# Altium project RS2-708_V010.PrjPCB (part 3 of 6)

## Sheet Serial.SchDoc
size A4
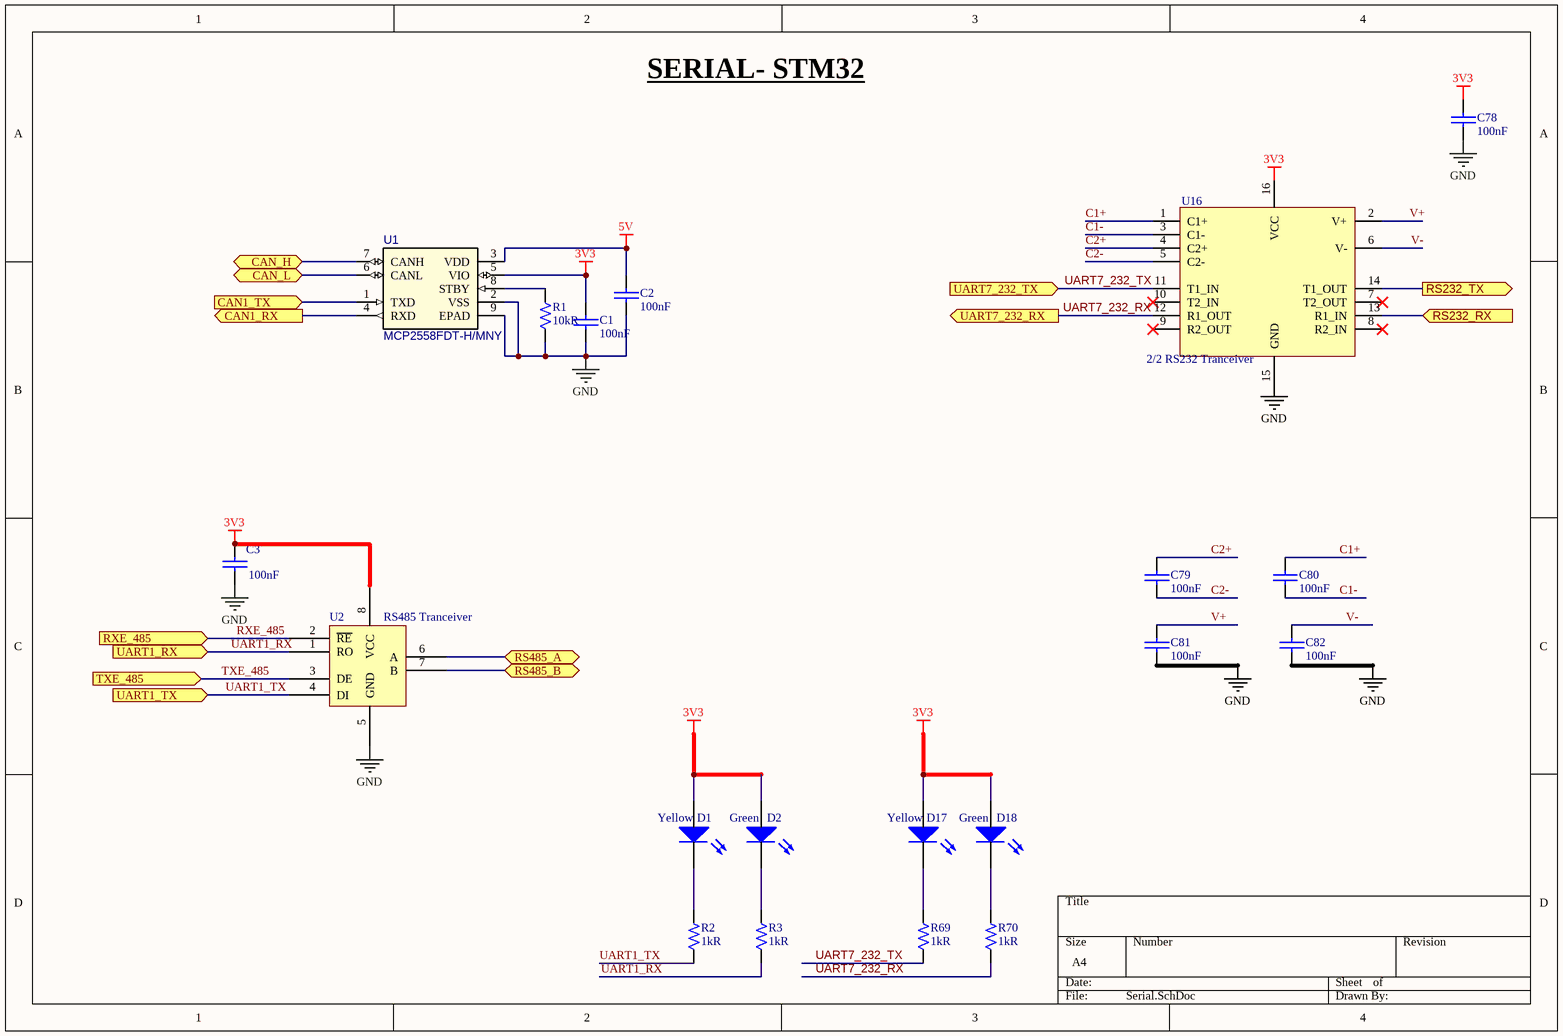
[diagram p4: Serial.SchDoc]

### Parts
C1  Capacitance: 100nF  [CAP0402]  (hidden comment: Capacitor)
C2  Capacitance: 100nF  [CAP0402]  (hidden comment: Capacitor)
C3  Capacitance: 100nF  [CAP0402]  (hidden comment: Capacitor)
C78  Capacitance: 100nF  [CAP0402]  (hidden comment: Capacitor)
C79  Capacitance: 100nF  [CAP0402]  (hidden comment: Capacitor)
C80  Capacitance: 100nF  [CAP0402]  (hidden comment: Capacitor)
C81  Capacitance: 100nF  [CAP0402]  (hidden comment: Capacitor)
C82  Capacitance: 100nF  [CAP0402]  (hidden comment: Capacitor)
D1  Colour: Yellow  [LED-0603-YELLOW]  (hidden comment: LED)
D2  Colour: Green  [LED-0603-GREEN]  (hidden comment: LED)
D17  Colour: Yellow  [LED-0603-YELLOW]  (hidden comment: LED)
D18  Colour: Green  [LED-0603-GREEN]  (hidden comment: LED)
R1  Resistance: 10kR  [RES0402]  (hidden comment: Resistor)
R2  Resistance: 1kR  [RES0402]  (hidden comment: Resistor)
R3  Resistance: 1kR  [RES0402]  (hidden comment: Resistor)
R69  Resistance: 1kR  [RES0402]  (hidden comment: Resistor)
R70  Resistance: 1kR  [RES0402]  (hidden comment: Resistor)
U1  MCP2558FDT-H/MNY  [TDFN8_2x3_MN]
U2  RS485 Tranceiver  [MAX22501EATA+]
U16  2/2 RS232 Tranceiver  [ST3232ECTR]

### Ports
CAN1_RX (out), CAN1_TX (in), CAN_H (bidir), CAN_L (bidir), RS232_RX (in), RS232_TX (out), RS485_A (bidir), RS485_B (bidir), RXE_485 (in), TXE_485 (in), UART1_RX (in), UART1_TX (in), UART7_232_RX (out), UART7_232_TX (in)

### Nets
3V3: C1.1 C3.1 C78.1 D1.2 D2.2 D17.2 D18.2 U1.5(VIO) U2.8(VCC) U16.16(VCC)
5V: C2.1 U1.3(VDD)
GND: C1.2 C2.2 C3.2 C78.2 C81.2 C82.2 R1.1 U1.2(VSS) U1.9(EPAD) U2.5(GND) U16.15(GND)
C1+: C80.1 U16.1(C1+)
C1-: C80.2 U16.3(C1-)
C2+: C79.1 U16.4(C2+)
C2-: C79.2 U16.5(C2-)
CAN1_RX: U1.4(RXD) ; port CAN1_RX
CAN1_TX: U1.1(TXD) ; port CAN1_TX
CAN_H: U1.7(CANH) ; port CAN_H
CAN_L: U1.6(CANL) ; port CAN_L
RS232_RX: U16.13(R1_IN) ; port RS232_RX
RS232_TX: U16.14(T1_OUT) ; port RS232_TX
RS485_A: U2.6(A) ; port RS485_A
RS485_B: U2.7(B) ; port RS485_B
RXE_485: U2.2(~{RE}) ; port RXE_485
TXE_485: U2.3(DE) ; port TXE_485
UART1_RX: R3.1 U2.1(RO) ; port UART1_RX
UART1_TX: R2.1 U2.4(DI) ; port UART1_TX
UART7_232_RX: R70.1 U16.12(R1_OUT) ; port UART7_232_RX
UART7_232_TX: R69.1 U16.11(T1_IN) ; port UART7_232_TX
V+: C81.1 U16.2(V+)
V-: C82.1 U16.6(V-)
NetD1_1: D1.1 R2.2
NetD2_1: D2.1 R3.2
NetD17_1: D17.1 R69.2
NetD18_1: D18.1 R70.2
NetR1_2: R1.2 U1.8(STBY)

Not connected (* = marked no-connect by the designer): U16 7(T2_OUT)* 8(R2_IN)* 9(R2_OUT)* 10(T2_IN)*

### Notes on the sheet
- SERIAL- STM32

### Library data of the parts
C1-C3 C78-C82 = Capacitor: Manufacturer: TDK; Manufacturer Part Number: CGA2B3X7R1H104K050BB; Voltage Rating: 50V; Tolerance: 10%; Dielectric: X7R; Supplier 1: Digi-Key; Supplier Part Number 1: 445-6899-1-ND; Stock 1: 14098587; Mount: Surface Mount; Case/Package: 0402; Weight: 2.3E-05oz; Case Code (Metric): 1005; Case Code (Imperial): 0402; Min Operating Temperature: -55°C; Max Operating Temperature: 125°C; Packaging: Tape and Reel; Package Quantity: 1; Voltage Rating (DC): 50V; Termination: SMD/SMT; Composition: Ceramic; Voltage: 50V; Length: 1mm; Height: 0.5mm; Width: 0.02inch; Thickness: 0.022inch; Depth: 0.5mm; Ratings: AEC-Q200; REACH SVHC: No SVHC; Lead Free: Lead Free; ComponentLink1URL: http://product.tdk.com/capacitor/mlcc/en/documents/mlccspec_automotive_general_midvoltage_en.pdf?src-supplier=Future+Electronics; ComponentLink1Description: http://product.tdk.com/capacitor/mlcc/en/documents/mlccspec_automotive_general_midvoltage_en.pdf?src-supplier=Future+Electronics; ComponentLink2URL: http://www.farnell.com/datasheets/1807242.pdf?src-supplier=Element14; ComponentLink2Description: http://www.farnell.com/datasheets/1807242.pdf?src-supplier=Element14; ComponentLink3URL: http://www.mouser.com/ds/2/400/lcc_automotive_general_en-843974.pdf?src-supplier=Mouser; ComponentLink3Description: http://www.mouser.com/ds/2/400/lcc_automotive_general_en-843974.pdf?src-supplier=Mouser; ComponentLink4URL: http://www.farnell.com/datasheets/1936565.pdf?src-supplier=Element14; ComponentLink4Description: http://www.farnell.com/datasheets/1936565.pdf?src-supplier=Element14; ComponentLink5URL: http://www.farnell.com/datasheets/1735392.pdf?src-supplier=Element14; ComponentLink5Description: http://www.farnell.com/datasheets/1735392.pdf?src-supplier=Element14
D1 D17 = LED: Manufacturer: Wurth Electronics Inc.; Manufacturer Part Number: 150060YS75000; Component Type: Yellow 590nm LED Indication - Discrete 2V 0603 (1608 Metric); Price: 0.39; Supplier: Digi-Key; Supplier Part Number: 732-4981-1-ND
D2 D18 = LED: Manufacturer: Wurth Electronics Inc.; Manufacturer Part Number: 150060GS75000; Component Type: Green 520nm LED Indication - Discrete 3.2V 0603 (1608 Metric); Price: 0.39; Supplier: Digi-Key; Supplier Part Number: 732-4971-1-ND
R1 = Resistor: Manufacturer 1: Panasonic; Manufacturer Part Number 1: ERJ-2RKF1002X; Power Rating: 100mW; Tolerance: 1%; Voltage Rating: 50V; Temperature Coefficient: 100ppm/°C; Supplier 1: Digi-Key; Supplier Part Number 1: P10.0KLDKR-ND; Stock 1: 3290329; Pricing 1: 1=0,10000, 10=0,04100, 100=0,01680, 1000=0,00753, 2500=0,00653, 5000=0,00540 (USD); RoHS: Yes; Mount: Surface Mount; Case/Package: 0402; Number of Pins: 2; Contact Plating: Tin; Case Code (Metric): 1005; Case Code (Imperial): 0402; Min Operating Temperature: -55°C; Max Operating Temperature: 155°C; Packaging: Tape and Reel; Package Quantity: 1; Voltage Rating (DC): 50V; Features: Automotive AEC-Q200; Max Power Dissipation: 100mW; Composition: Thick Film; Number of Terminations: 2; Termination: SMD/SMT; Military Standard: Not; Length: 1mm; Height: 0.35mm; Width: 0.02inch; Depth: 0.5mm; Radiation Hardening: No; Lead Free: Lead Free; REACH SVHC: No SVHC; ComponentLink1URL: https://datasheet.ciiva.com/11821/0900766b80f80784-11821171.pdf?src-supplier=RSComponents; ComponentLink1Description: https://datasheet.ciiva.com/11821/0900766b80f80784-11821171.pdf?src-supplier=RSComponents; ComponentLink2URL: https://datasheet.ciiva.com/16199/aoa0000ce2-16199478.pdf?src-supplier=Future+Electronics; ComponentLink2Description: https://datasheet.ciiva.com/16199/aoa0000ce2-16199478.pdf?src-supplier=Future+Electronics; ComponentLink3URL: https://datasheet.ciiva.com/17212/aoa0000ce2-17212102.pdf?src-supplier=Avnet+Europe; ComponentLink3Description: https://datasheet.ciiva.com/17212/aoa0000ce2-17212102.pdf?src-supplier=Avnet+Europe; ComponentLink4URL: https://datasheet.ciiva.com/24023/aoa0000ce2-24023017.pdf?src-supplier=Mouser; ComponentLink4Description: https://datasheet.ciiva.com/24023/aoa0000ce2-24023017.pdf?src-supplier=Mouser; ComponentLink5URL: https://datasheet.ciiva.com/28514/1678782-28514185.pdf?src-supplier=Element14; ComponentLink5Description: https://datasheet.ciiva.com/28514/1678782-28514185.pdf?src-supplier=Element14; ComponentLink6URL: https://datasheet.ciiva.com/43467/1678782-43467402.pdf?src-supplier=Farnell; ComponentLink6Description: https://datasheet.ciiva.com/43467/1678782-43467402.pdf?src-supplier=Farnell; ComponentLink7URL: https://datasheet.ciiva.com/27055/1987020-27055643.pdf?src-supplier=Jameco; ComponentLink7Description: https://datasheet.ciiva.com/27055/1987020-27055643.pdf?src-supplier=Jameco; ComponentLink8URL: https://datasheet.ciiva.com/48531/aoa0000ce2-48531069.pdf?src-supplier=Avnet; ComponentLink8Description: https://datasheet.ciiva.com/48531/aoa0000ce2-48531069.pdf?src-supplier=Avnet; ComponentLink9URL: https://datasheet.ciiva.com/9194/aoa0000ce2-9194142.pdf?src-supplier=Avnet; ComponentLink9Description: https://datasheet.ciiva.com/9194/aoa0000ce2-9194142.pdf?src-supplier=Avnet; ComponentLink10URL: https://datasheet.ciiva.com/16782/70260748-16782590.pdf?src-supplier=Allied+Electronics; ComponentLink10Description: https://datasheet.ciiva.com/16782/70260748-16782590.pdf?src-supplier=Allied+Electronics; ComponentLink11URL: https://datasheet.ciiva.com/16786/70260748-16786734.pdf?src-supplier=Allied+Electronics; ComponentLink11Description: https://datasheet.ciiva.com/16786/70260748-16786734.pdf?src-supplier=Allied+Electronics; ComponentLink12URL: https://datasheet.ciiva.com/30201/aoa0000ce2-30201022.pdf?src-supplier=Onlinecomponents.com; ComponentLink12Description: https://datasheet.ciiva.com/30201/aoa0000ce2-30201022.pdf?src-supplier=Onlinecomponents.com
R2 R3 R69 R70 = Resistor: Manufacturer 1: Panasonic; Manufacturer Part Number 1: ERJ-2GEJ102X; Temperature Coefficient: 200ppm/°C; Voltage Rating (DC): 50V; Tolerance: 5%; Power Rating: 100mW; Supplier 1: Digi-Key; Supplier Part Number 1: P1.0KJCT-ND; Stock 1: 3554258; Pricing 1: 1=0,10000, 10=0,03200, 100=0,01290, 1000=0,00578, 2500=0,00502, 5000=0,00414 (USD); RoHS: Yes; Mount: Surface Mount; Case/Package: 0402; Case Code (Metric): 1005; Case Code (Imperial): 0402; Contact Plating: Tin; Min Operating Temperature: -55°C; Max Operating Temperature: 155°C; Composition: Thick Film; Number of Terminations: 2; Termination: SMD/SMT; Military Standard: Not; Packaging: Tape and Reel; Voltage Rating: 50V; Package Quantity: 1; Features: Automotive AEC-Q200; Max Power Dissipation: 100mW; Working Voltage: 50V; Length: 1mm; Height: 0.35mm; Depth: 0.5mm; Width: 0.02inch; Radiation Hardening: No; Lead Free: Lead Free; REACH SVHC: No SVHC; ComponentLink1URL: https://datasheet.ciiva.com/11821/0900766b80f806dd-11821202.pdf?src-supplier=RSComponents; ComponentLink1Description: https://datasheet.ciiva.com/11821/0900766b80f806dd-11821202.pdf?src-supplier=RSComponents; ComponentLink2URL: https://datasheet.ciiva.com/34303/1986781-34303542.pdf?src-supplier=Jameco; ComponentLink2Description: https://datasheet.ciiva.com/34303/1986781-34303542.pdf?src-supplier=Jameco; ComponentLink3URL: https://datasheet.ciiva.com/16762/70260739-16762170.pdf?src-supplier=Allied+Electronics; ComponentLink3Description: https://datasheet.ciiva.com/16762/70260739-16762170.pdf?src-supplier=Allied+Electronics; ComponentLink4URL: https://datasheet.ciiva.com/17215/aoa0000ce1-17215306.pdf?src-supplier=Avnet+Europe; ComponentLink4Description: https://datasheet.ciiva.com/17215/aoa0000ce1-17215306.pdf?src-supplier=Avnet+Europe; ComponentLink5URL: https://datasheet.ciiva.com/43460/1500035-43460379.pdf?src-supplier=Farnell; ComponentLink5Description: https://datasheet.ciiva.com/43460/1500035-43460379.pdf?src-supplier=Farnell; ComponentLink6URL: https://datasheet.ciiva.com/16199/aoa0000ce1-16199541.pdf?src-supplier=Future+Electronics; ComponentLink6Description: https://datasheet.ciiva.com/16199/aoa0000ce1-16199541.pdf?src-supplier=Future+Electronics; ComponentLink7URL: https://datasheet.ciiva.com/30219/4aoa0000ce1-30219159.pdf?src-supplier=Onlinecomponents.com; ComponentLink7Description: https://datasheet.ciiva.com/30219/4aoa0000ce1-30219159.pdf?src-supplier=Onlinecomponents.com; ComponentLink8URL: https://datasheet.ciiva.com/22783/1500035-22783817.pdf?src-supplier=Farnell; ComponentLink8Description: https://datasheet.ciiva.com/22783/1500035-22783817.pdf?src-supplier=Farnell; ComponentLink9URL: https://datasheet.ciiva.com/48531/aoa0000ce1-48531081.pdf?src-supplier=Avnet; ComponentLink9Description: https://datasheet.ciiva.com/48531/aoa0000ce1-48531081.pdf?src-supplier=Avnet; ComponentLink10URL: https://datasheet.ciiva.com/46386/1500035-46386458.pdf?src-supplier=Element14; ComponentLink10Description: https://datasheet.ciiva.com/46386/1500035-46386458.pdf?src-supplier=Element14; ComponentLink11URL: https://datasheet.ciiva.com/16511/aoa0000ce1-16511421.pdf?src-supplier=Avnet+Asia; ComponentLink11Description: https://datasheet.ciiva.com/16511/aoa0000ce1-16511421.pdf?src-supplier=Avnet+Asia; ComponentLink12URL: https://datasheet.ciiva.com/46371/1500035-46371935.pdf?src-supplier=Element14; ComponentLink12Description: https://datasheet.ciiva.com/46371/1500035-46371935.pdf?src-supplier=Element14
U1 = MCP2558FDT-H/MNY: Can Fd Transceiver With Silent Mode / 8 Tdfn 2X3X0.8Mm T/r; Vendor: Microchip; Receiver Hysteresis: 200mV; Manufacturer_Part_Number: MCP2558FDT-H/MNY; Supplier 1: Digi-Key; Supplier Part Number 1: MCP2558FDT-H/MNYCT-ND; Manufacturer 1: Microchip; Manufacturer Part Number 1: MCP2558FDT-H/MNY; RoHS: Yes; Category: Interface ICs; Stock 1: 6428; Pricing 1: 1=0,85000, 25=0,70000, 100=0,69000 (USD); Mount: Surface Mount; Min Operating Temperature: -40°C; Max Operating Temperature: 150°C; Packaging: Tape and Reel; RoHS Compliant: Yes; ComponentLink1URL: http://www.microchip.com/mymicrochip/filehandler.aspx?ddocname=en585652&src-supplier=Digi-Key; ComponentLink1Description: http://www.microchip.com/mymicrochip/filehandler.aspx?ddocname=en585652&src-supplier=Digi-Key
U2 = MAX22501EATA+: Manufacturer: Maxim Integrated; Price: 2.91; Supplier Part Number: MAX22501EATA+-ND; Manufacturer Part Number: MAX22501EATA+; Component Type: 1/1 Transceiver Half RS422, RS485 8-TDFN (3x3); Supplier: Digi-Key
U16 = ST3232ECTR: Manufacturer: STMicroelectronics; Price: 1.41; Manufacturer Part Number: ST3232ECTR; Supplier: Digi-Key; Supplier Part Number: 497-6538-1-ND; Component Type: 2/2 Transceiver Full RS232 16-TSSOP

## Sheet STM32.SchDoc
size A4
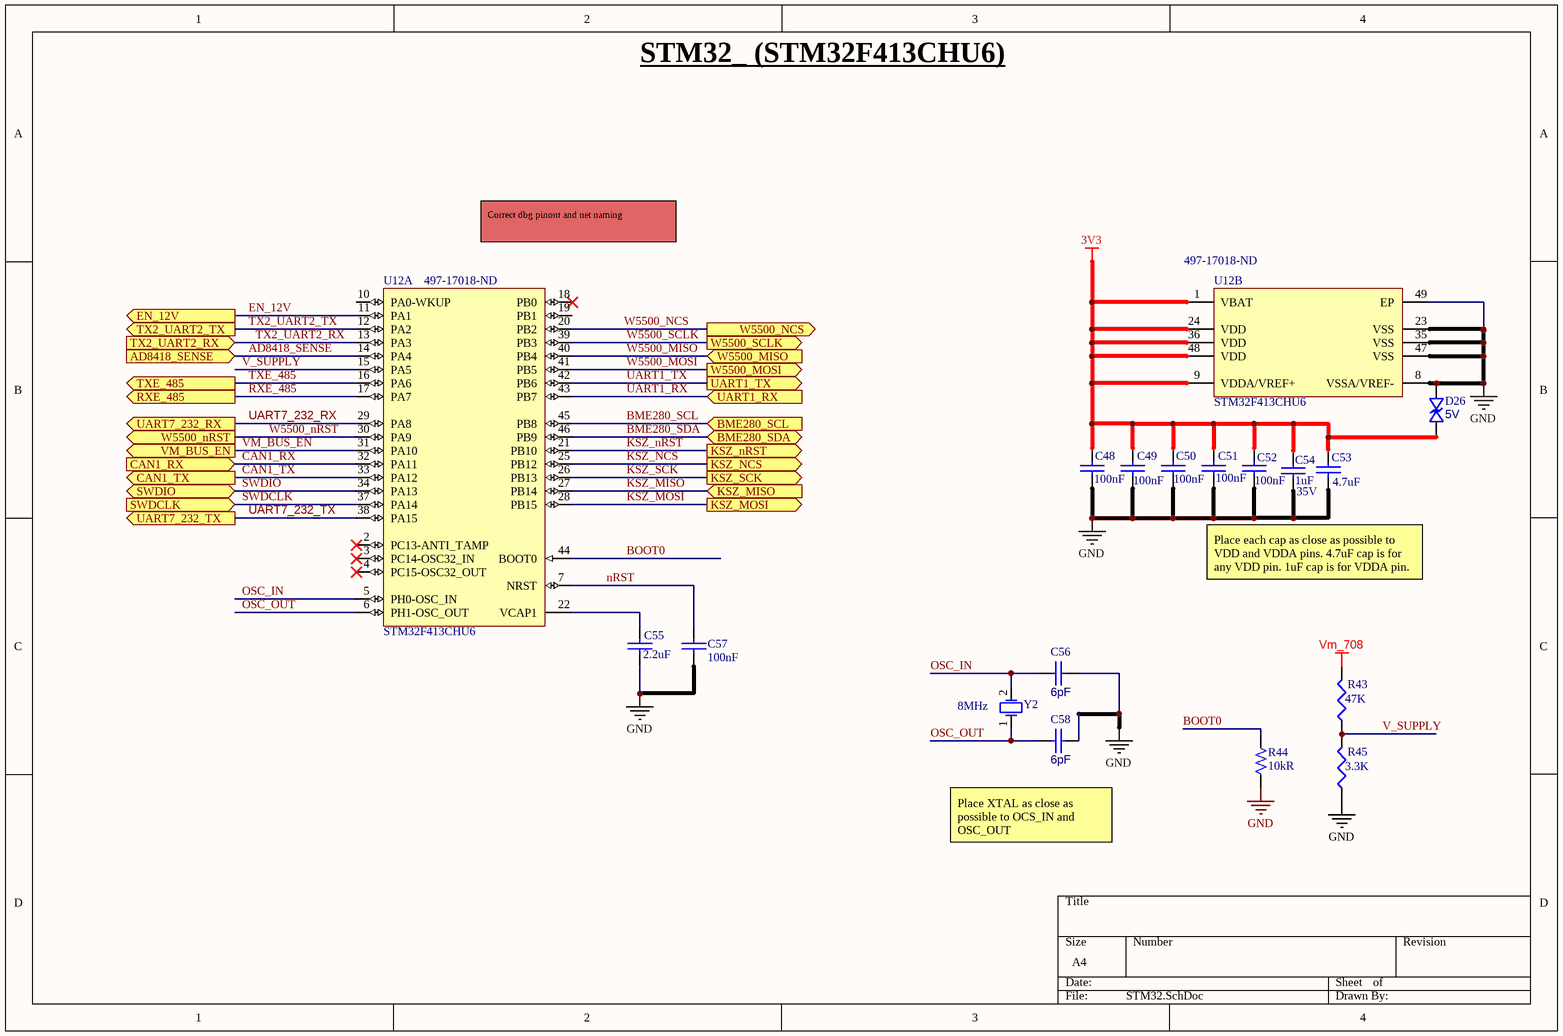
[diagram p5: STM32.SchDoc]

### Parts
C48  Capacitance: 100nF  [CAP0402]  (hidden comment: Capacitor)
C49  Capacitance: 100nF  [CAP0402]  (hidden comment: Capacitor)
C50  Capacitance: 100nF  [CAP0402]  (hidden comment: Capacitor)
C51  Capacitance: 100nF  [CAP0402]  (hidden comment: Capacitor)
C52  Capacitance: 100nF  [CAP0402]  (hidden comment: Capacitor)
C53  Capacitance: 4.7uF  [CAP0402]  (hidden comment: Capacitor)
C54  Voltage Rating: 35V  Capacitance: 1uF  [CAP0402]  (hidden comment: Capacitor)
C55  Capacitance: 2.2uF  [CAP0402]  (hidden comment: Capacitor)
C56  Capacitance: 6pF  [CAP0402]  (hidden comment: Capacitor)
C57  Capacitance: 100nF  [CAP0402]  (hidden comment: Capacitor)
C58  Capacitance: 6pF  [CAP0402]  (hidden comment: Capacitor)
D26  Reverse Standoff Voltage: 5V  [SLP1006P2T]  (hidden comment: TVS-Bidirectional)
R43  value 47K  [RES0402]  (hidden comment: Res)
R44  Resistance: 10kR  [RES0402]  (hidden comment: Resistor)
R45  value 3.3K  [RES0402]  (hidden comment: Res)
U12  STM32F413CHU6  Supplier Part Number 1: 497-17018-ND  [STM-UFQFPN48_M]  (parts A,B of 2)
Y2  value 8MHz  [2-SMD-XTAL (3.2x2.5)]  (hidden comment: Osc)

### Ports
AD8418_SENSE (in), BME280_SCL (in), BME280_SDA (bidir), CAN1_RX (in), CAN1_TX (out), EN_12V (out), KSZ_MISO (in), KSZ_MOSI (out), KSZ_NCS (out), KSZ_nRST (out), KSZ_SCK (out), RXE_485 (out), SWDCLK (in), SWDIO (bidir), TX2_UART2_RX (in), TX2_UART2_TX (out), TXE_485 (out), UART1_RX (in), UART1_TX (out), UART7_232_RX (out), UART7_232_TX (out), VM_BUS_EN (out), W5500_MISO (in), W5500_MOSI (out), W5500_NCS (out), W5500_nRST (out), W5500_SCLK (out)

### Nets
3V3: C48.1 C49.1 C50.1 C51.1 C52.1 C53.1 C54.2 D26.2 U12.1(VBAT) U12.9(VDDA/VREF+) U12.24(VDD) U12.36(VDD) U12.48(VDD)
GND: C48.2 C49.2 C50.2 C51.2 C52.2 C53.2 C54.1 C55.2 C56.1 C57.2 C58.1 D26.1 R44.2 R45.1 U12.8(VSSA/VREF-) U12.23(VSS) U12.35(VSS) U12.47(VSS) U12.49(EP)
Vm_708: R43.2
AD8418_SENSE: U12.14(PA4) ; port AD8418_SENSE
BME280_SCL: U12.45(PB8) ; port BME280_SCL
BME280_SDA: U12.46(PB9) ; port BME280_SDA
BOOT0: R44.1 U12.44(BOOT0)
CAN1_RX: U12.32(PA11) ; port CAN1_RX
CAN1_TX: U12.33(PA12) ; port CAN1_TX
EN_12V: U12.11(PA1) ; port EN_12V
KSZ_MISO: U12.27(PB14) ; port KSZ_MISO
KSZ_MOSI: U12.28(PB15) ; port KSZ_MOSI
KSZ_NCS: U12.25(PB12) ; port KSZ_NCS
KSZ_nRST: U12.21(PB10) ; port KSZ_nRST
KSZ_SCK: U12.26(PB13) ; port KSZ_SCK
nRST: C57.1 U12.7(NRST)
OSC_IN: C56.2 U12.5(PH0-OSC_IN) Y2.2
OSC_OUT: C58.2 U12.6(PH1-OSC_OUT) Y2.1
RXE_485: U12.17(PA7) ; port RXE_485
SWDCLK: U12.37(PA14) ; port SWDCLK
SWDIO: U12.34(PA13) ; port SWDIO
TX2_UART2_RX: U12.13(PA3) ; port TX2_UART2_RX  [project net TX2_DBG_UART1_RX]
TX2_UART2_TX: U12.12(PA2) ; port TX2_UART2_TX  [project net TX2_DBG_UART1_TX]
TXE_485: U12.16(PA6) ; port TXE_485
UART1_RX: U12.43(PB7) ; port UART1_RX
UART1_TX: U12.42(PB6) ; port UART1_TX
UART7_232_RX: U12.29(PA8) ; port UART7_232_RX
UART7_232_TX: U12.38(PA15) ; port UART7_232_TX
V_SUPPLY: R43.1 R45.2 U12.15(PA5)
VM_BUS_EN: U12.31(PA10) ; port VM_BUS_EN
W5500_MISO: U12.40(PB4) ; port W5500_MISO
W5500_MOSI: U12.41(PB5) ; port W5500_MOSI
W5500_NCS: U12.20(PB2) ; port W5500_NCS
W5500_nRST: U12.30(PA9) ; port W5500_nRST
W5500_SCLK: U12.39(PB3) ; port W5500_SCLK
NetC55_1: C55.1 U12.22(VCAP1)

Not connected (* = marked no-connect by the designer): U12 2(PC13-ANTI_TAMP)* 3(PC14-OSC32_IN)* 4(PC15-OSC32_OUT)* 10(PA0-WKUP) 18(PB0)* 19(PB1)

### Notes on the sheet
- STM32_ (STM32F413CHU6)
- Correct dbg pinout and net naming
- Place each cap as close as possible to VDD and VDDA pins. 4.7uF cap is for any VDD pin. 1uF cap is for VDDA pin.
- Place XTAL as close as possible to OCS_IN and OSC_OUT

### Library data of the parts
C48-C52 C57 = Capacitor: as C1 on sheet Serial; Supplier 1: Digi-Key; Supplier Part Number 1: 445-6899-1-ND; Stock 1: 14098587; Mount: Surface Mount; Case/Package: 0402; Weight: 2.3E-05oz; Case Code (Metric): 1005; Case Code (Imperial): 0402; Min Operating Temperature: -55°C; Max Operating Temperature: 125°C; Packaging: Tape and Reel; Package Quantity: 1; Voltage Rating (DC): 50V; Termination: SMD/SMT; Composition: Ceramic; Voltage: 50V; Length: 1mm; Height: 0.5mm; Width: 0.02inch; Thickness: 0.022inch; Depth: 0.5mm; Ratings: AEC-Q200; REACH SVHC: No SVHC; Lead Free: Lead Free; ComponentLink1URL: http://product.tdk.com/capacitor/mlcc/en/documents/mlccspec_automotive_general_midvoltage_en.pdf?src-supplier=Future+Electronics; ComponentLink1Description: http://product.tdk.com/capacitor/mlcc/en/documents/mlccspec_automotive_general_midvoltage_en.pdf?src-supplier=Future+Electronics; ComponentLink2URL: http://www.farnell.com/datasheets/1807242.pdf?src-supplier=Element14; ComponentLink2Description: http://www.farnell.com/datasheets/1807242.pdf?src-supplier=Element14; ComponentLink3URL: http://www.mouser.com/ds/2/400/lcc_automotive_general_en-843974.pdf?src-supplier=Mouser; ComponentLink3Description: http://www.mouser.com/ds/2/400/lcc_automotive_general_en-843974.pdf?src-supplier=Mouser; ComponentLink4URL: http://www.farnell.com/datasheets/1936565.pdf?src-supplier=Element14; ComponentLink4Description: http://www.farnell.com/datasheets/1936565.pdf?src-supplier=Element14; ComponentLink5URL: http://www.farnell.com/datasheets/1735392.pdf?src-supplier=Element14; ComponentLink5Description: http://www.farnell.com/datasheets/1735392.pdf?src-supplier=Element14
C53 = Capacitor: Manufacturer 1: Samsung; Manufacturer Part Number 1: CL05A475MO5NUNC; Voltage Rating: 16V; Manufacturer: *; Manufacturer Part Number: *; Supplier: *; Supplier Part Number: *; Tolerance: *; Voltage: *; Footprint: *; Temperature Coefficient: *; Supplier 1: Digi-Key; Supplier Part Number 1: 1276-6836-1-ND; Stock 1: 2288634; Pricing 1: 1=0,41000, 10=0,29200, 100=0,19210, 500=0,14232, 1000=0,12097, 2500=0,11386, 5000=0,10674 (USD); RoHS: Yes; Mount: Surface Mount; Case/Package: 0402; Case Code (Metric): 1005; Case Code (Imperial): 0402; Min Operating Temperature: -55°C; Max Operating Temperature: 85°C; Packaging: Tape and Reel; Length: 0.039inch; Width: 0.02inch; Thickness: 0.022inch; ComponentLink1URL: http://www.samsungsem.com/kr/support/product-search/mlcc/CL05A475MO5NUNC.jsp?src-supplier=Digi-Key; ComponentLink1Description: http://www.samsungsem.com/kr/support/product-search/mlcc/CL05A475MO5NUNC.jsp?src-supplier=Digi-Key
C54 = Capacitor: Manufacturer 1: Murata; Manufacturer Part Number 1: GRM155R6YA105KE11D; Manufacturer: *; Manufacturer Part Number: *; Supplier: *; Supplier Part Number: *; Tolerance: *; Voltage: *; Footprint: *; Temperature Coefficient: *; Supplier 1: Digi-Key; Supplier Part Number 1: 490-10019-1-ND; Stock 1: 441965; Pricing 1: 1=0,26000, 10=0,18100, 100=0,10280, 500=0,07258, 1000=0,06350, 2500=0,06048, 5000=0,05594 (USD); RoHS: Yes; Mount: Surface Mount; Case/Package: 0402; Case Code (Imperial): 0402; Case Code (Metric): 1005; Min Operating Temperature: -55°C; Max Operating Temperature: 85°C; Packaging: Tape and Reel; Voltage Rating (DC): 35V; Length: 0.039inch; Width: 0.02inch; Thickness: 0.024inch; ComponentLink1URL: http://search.murata.co.jp/Ceramy/image/img/A01X/G101/ENG/GRM155R6YA105KE11-01.pdf?src-supplier=Digi-Key; ComponentLink1Description: http://search.murata.co.jp/Ceramy/image/img/A01X/G101/ENG/GRM155R6YA105KE11-01.pdf?src-supplier=Digi-Key; ComponentLink2URL: http://psearch.en.murata.com/capacitor/product/GRM155R6YA105KE11%23.pdf?src-supplier=Avnet; ComponentLink2Description: http://psearch.en.murata.com/capacitor/product/GRM155R6YA105KE11%23.pdf?src-supplier=Avnet
C55 = Capacitor: Manufacturer 1: Murata; Manufacturer Part Number 1: GRM155R61A225KE95D; Material: Ceramic; Dielectric: X5R; Voltage Rating (DC): 10V; Manufacturer: *; Manufacturer Part Number: *; Supplier: *; Supplier Part Number: *; Tolerance: *; Voltage: *; Footprint: *; Temperature Coefficient: *; Supplier 1: Digi-Key; Supplier Part Number 1: 490-10451-1-ND; Stock 1: 815357; Pricing 1: 1=0,11000, 10=0,08100, 100=0,03800, 500=0,02664, 1000=0,02205, 2500=0,02052, 5000=0,01878 (USD); RoHS: Yes; Mount: Surface Mount; Case/Package: 0402; Weight: 0.000212oz; Case Code (Metric): 1005; Case Code (Imperial): 0402; Min Operating Temperature: -55°C; Max Operating Temperature: 85°C; Termination: SMD/SMT; Package Quantity: 10000; Voltage Rating: 10V; Packaging: Tape and Reel; Length: 1mm; Height: 0.5mm; Thickness: 0.022inch; Depth: 0.5mm; Width: 0.5mm; REACH SVHC: No SVHC; Lead Free: Lead Free; ComponentLink1URL: http://www.mouser.com/ds/2/281/c02e-2905.pdf?src-supplier=Mouser; ComponentLink1Description: http://www.mouser.com/ds/2/281/c02e-2905.pdf?src-supplier=Mouser; ComponentLink2URL: http://components.arrow.com/part/dataview/0323_04264073?src-supplier=Arrow+Europe; ComponentLink2Description: http://components.arrow.com/part/dataview/0323_04264073?src-supplier=Arrow+Europe; ComponentLink3URL: http://www.farnell.com/datasheets/1872202.pdf?src-supplier=Farnell; ComponentLink3Description: http://www.farnell.com/datasheets/1872202.pdf?src-supplier=Farnell; ComponentLink4URL: http://www.farnell.com/datasheets/2047915.pdf?src-supplier=Farnell; ComponentLink4Description: http://www.farnell.com/datasheets/2047915.pdf?src-supplier=Farnell; ComponentLink5URL: http://www.farnell.com/datasheets/1872202.pdf?src-supplier=Element14; ComponentLink5Description: http://www.farnell.com/datasheets/1872202.pdf?src-supplier=Element14; ComponentLink6URL: https://search.murata.co.jp/Ceramy/image/img/A01X/G101/ENG/GRM155R61A225KE95-01.pdf?src-supplier=Digi-Key; ComponentLink6Description: https://search.murata.co.jp/Ceramy/image/img/A01X/G101/ENG/GRM155R61A225KE95-01.pdf?src-supplier=Digi-Key; ComponentLink7URL: http://www.farnell.com/datasheets/1872202.pdf?src-supplier=Newark; ComponentLink7Description: http://www.farnell.com/datasheets/1872202.pdf?src-supplier=Newark; ComponentLink8URL: http://psearch.en.murata.com/capacitor/product/GRM155R61A225KE95%23.pdf?src-supplier=Avnet; ComponentLink8Description: http://psearch.en.murata.com/capacitor/product/GRM155R61A225KE95%23.pdf?src-supplier=Avnet; ComponentLink9URL: http://www.farnell.com/datasheets/2047915.pdf?src-supplier=Element14; ComponentLink9Description: http://www.farnell.com/datasheets/2047915.pdf?src-supplier=Element14; ComponentLink10URL: http://www.farnell.com/datasheets/2047915.pdf?src-supplier=Newark; ComponentLink10Description: http://www.farnell.com/datasheets/2047915.pdf?src-supplier=Newark
C56 C58 = Capacitor: CAP CER 6PF 100V C0G/NP0 0402; Manufacturer 1: KEMET; Manufacturer Part Number 1: CBR04C609B1GAC; Manufacturer: *; Manufacturer Part Number: *; Supplier: *; Supplier Part Number: *; Tolerance: *; Voltage: *; Footprint: *; Temperature Coefficient: *; Supplier 1: Digi-Key; Supplier Part Number 1: 399-8610-1-ND; RoHS: Yes; Category: Ceramic Capacitors; Stock 1: 20446; Pricing 1: 1=0,34000, 10=0,23300, 50=0,15540, 100=0,13200, 500=0,09320, 1000=0,08154, 2500=0,07766, 5000=0,07184 (USD); Mount: Surface Mount; Case/Package: 0402; Case Code (Metric): 1005; Case Code (Imperial): 0402; Min Operating Temperature: -55°C; Max Operating Temperature: 125°C; Package Quantity: 1; Voltage Rating: 100V; Packaging: Tape and Reel; Voltage Rating (DC): 100V; Series: CBR; Length: 0.039inch; Width: 0.02inch; Thickness: 0.022inch; RoHS Compliant: Yes; ComponentLink1URL: https://datasheet.ciiva.com/6257/kem-c1030-cbr-smd-6257478.pdf?src-supplier=Digi-Key; ComponentLink1Description: https://datasheet.ciiva.com/6257/kem-c1030-cbr-smd-6257478.pdf?src-supplier=Digi-Key; ComponentLink2URL: https://datasheet.ciiva.com/6257/kem-c1030-cbr-smd-6257482.pdf?src-supplier=Digi-Key; ComponentLink2Description: https://datasheet.ciiva.com/6257/kem-c1030-cbr-smd-6257482.pdf?src-supplier=Digi-Key
D26 = TVS-Bidirectional: TVS DIODE 5V 20V SLP1006P2T; Manufacturer 1: Semtech; Manufacturer Part Number 1: RCLAMP0531TQTCT; Peak Pulse Current: 4A; Element Configuration: Single; Number of Bidirectional Channels: 1; Min Breakdown Voltage: 6V; Peak Pulse Power: 80W; Power Line Protection: No; Leakage Current: 100nA; Supplier 1: Digi-Key; Supplier Part Number 1: RCLAMP0531TQTCTCT-ND; RoHS: Yes; Category: TVS Diodes; Stock 1: 9000; Pricing 1: 1=1,09000, 10=0,97400, 100=0,69300, 500=0,58740, 1000=0,47850 (USD); Mount: Surface Mount; Case/Package: 0402; Number of Pins: 2; Case Code (Imperial): 0402; Case Code (Metric): 1006; Min Operating Temperature: -40°C; Max Operating Temperature: 125°C; Direction: Bidirectional; Packaging: Tape and Reel; Package Quantity: 3000; Resistor Type: Zener; Clamping Voltage: 20V; Working Voltage: 5V; Length: 1mm; Depth: 0.6mm; Radiation Hardening: No; Lead Free: Lead Free; ComponentLink1URL: https://datasheet.ciiva.com/26946/getdatasheetpartid-791156-26946873.pdf?src-supplier=Verical; ComponentLink1Description: https://datasheet.ciiva.com/26946/getdatasheetpartid-791156-26946873.pdf?src-supplier=Verical; ComponentLink2URL: https://datasheet.ciiva.com/29574/rclamp0531tq-29574060.pdf?src-supplier=Digi-Key; ComponentLink2Description: https://datasheet.ciiva.com/29574/rclamp0531tq-29574060.pdf?src-supplier=Digi-Key
R43 = Resistor: Manufacturer: Yageo; Manufacturer Part Number: RC0402JR-0747KL; Power Rating: 0.063W; Tolerance: 1%; Component Type: Resistor; Price: 0.15; Supplier: Digi-Key; Supplier Part Number: 311-47KJRCT-ND; Footprint: 0402 (1005 Metric)
R44 = Resistor: as R1 on sheet Serial; Supplier 1: Digi-Key; Supplier Part Number 1: P10.0KLDKR-ND; Stock 1: 3290329; Pricing 1: 1=0,10000, 10=0,04100, 100=0,01680, 1000=0,00753, 2500=0,00653, 5000=0,00540 (USD); RoHS: Yes; Mount: Surface Mount; Case/Package: 0402; Number of Pins: 2; Contact Plating: Tin; Case Code (Metric): 1005; Case Code (Imperial): 0402; Min Operating Temperature: -55°C; Max Operating Temperature: 155°C; Packaging: Tape and Reel; Package Quantity: 1; Voltage Rating (DC): 50V; Features: Automotive AEC-Q200; Max Power Dissipation: 100mW; Composition: Thick Film; Number of Terminations: 2; Termination: SMD/SMT; Military Standard: Not; Length: 1mm; Height: 0.35mm; Width: 0.02inch; Depth: 0.5mm; Radiation Hardening: No; Lead Free: Lead Free; REACH SVHC: No SVHC; ComponentLink1URL: https://datasheet.ciiva.com/11821/0900766b80f80784-11821171.pdf?src-supplier=RSComponents; ComponentLink1Description: https://datasheet.ciiva.com/11821/0900766b80f80784-11821171.pdf?src-supplier=RSComponents; ComponentLink2URL: https://datasheet.ciiva.com/16199/aoa0000ce2-16199478.pdf?src-supplier=Future+Electronics; ComponentLink2Description: https://datasheet.ciiva.com/16199/aoa0000ce2-16199478.pdf?src-supplier=Future+Electronics; ComponentLink3URL: https://datasheet.ciiva.com/17212/aoa0000ce2-17212102.pdf?src-supplier=Avnet+Europe; ComponentLink3Description: https://datasheet.ciiva.com/17212/aoa0000ce2-17212102.pdf?src-supplier=Avnet+Europe; ComponentLink4URL: https://datasheet.ciiva.com/24023/aoa0000ce2-24023017.pdf?src-supplier=Mouser; ComponentLink4Description: https://datasheet.ciiva.com/24023/aoa0000ce2-24023017.pdf?src-supplier=Mouser; ComponentLink5URL: https://datasheet.ciiva.com/28514/1678782-28514185.pdf?src-supplier=Element14; ComponentLink5Description: https://datasheet.ciiva.com/28514/1678782-28514185.pdf?src-supplier=Element14; ComponentLink6URL: https://datasheet.ciiva.com/43467/1678782-43467402.pdf?src-supplier=Farnell; ComponentLink6Description: https://datasheet.ciiva.com/43467/1678782-43467402.pdf?src-supplier=Farnell; ComponentLink7URL: https://datasheet.ciiva.com/27055/1987020-27055643.pdf?src-supplier=Jameco; ComponentLink7Description: https://datasheet.ciiva.com/27055/1987020-27055643.pdf?src-supplier=Jameco; ComponentLink8URL: https://datasheet.ciiva.com/48531/aoa0000ce2-48531069.pdf?src-supplier=Avnet; ComponentLink8Description: https://datasheet.ciiva.com/48531/aoa0000ce2-48531069.pdf?src-supplier=Avnet; ComponentLink9URL: https://datasheet.ciiva.com/9194/aoa0000ce2-9194142.pdf?src-supplier=Avnet; ComponentLink9Description: https://datasheet.ciiva.com/9194/aoa0000ce2-9194142.pdf?src-supplier=Avnet; ComponentLink10URL: https://datasheet.ciiva.com/16782/70260748-16782590.pdf?src-supplier=Allied+Electronics; ComponentLink10Description: https://datasheet.ciiva.com/16782/70260748-16782590.pdf?src-supplier=Allied+Electronics; ComponentLink11URL: https://datasheet.ciiva.com/16786/70260748-16786734.pdf?src-supplier=Allied+Electronics; ComponentLink11Description: https://datasheet.ciiva.com/16786/70260748-16786734.pdf?src-supplier=Allied+Electronics; ComponentLink12URL: https://datasheet.ciiva.com/30201/aoa0000ce2-30201022.pdf?src-supplier=Onlinecomponents.com; ComponentLink12Description: https://datasheet.ciiva.com/30201/aoa0000ce2-30201022.pdf?src-supplier=Onlinecomponents.com
R45 = Resistor: Manufacturer: Yageo; Manufacturer Part Number: RC0402FR-073K3L; Power Rating: 0.063W; Tolerance: 1%; Component Type: Resistor; Price: 0.14; Supplier: Digikey; Supplier Part Number: 311-3.30KLRCT-ND
U12 = STM32F413CHU: ARM Cortex-M4 32-bit MCU+FPU, 105 DMIPS, 128 kB Flash, 64 kB Internal RAM, 36 I/Os, 48-pin UFQFPN, -40 to 85 degC, Tray; Manufacturer: STMicroelectronics; Interface: I2C,USB,IrDA,MMC,SDIO,UART,USART; Peripherals: Brown-out Detect/Reset,POR,PWM,WDT,DMA,LCD; Frequency: 100MHz; Number of I/Os: 36; Memory Size: 1.5MB; Component Type: 'ARM® Cortex®-M4, 32Bit, 100mhz, 48-UFQFPN (7x7); Manufacturer Part Number: STM32F413CHU6; Supplier 1: Digi-Key; Stock 1: 2911; Case/Package: UFQFPN; Min Operating Temperature: -40°C; Max Operating Temperature: 85°C; Memory Type: FLASH; Packaging: Tray; Core Architecture: ARM; Oscillator Type: Internal
Y2 = Crystal Oscillator: Manufacturer: NDK; Manufacturer Part Number: NX3225GD-8MHZ-STD-CRA-3; Component Type: Crystal Oscillator; Price: 0.94; Supplier: Digi-Key; Supplier Part Number: 644-1178-1-ND

## Sheet VoltageRegulators.SchDoc
size A4
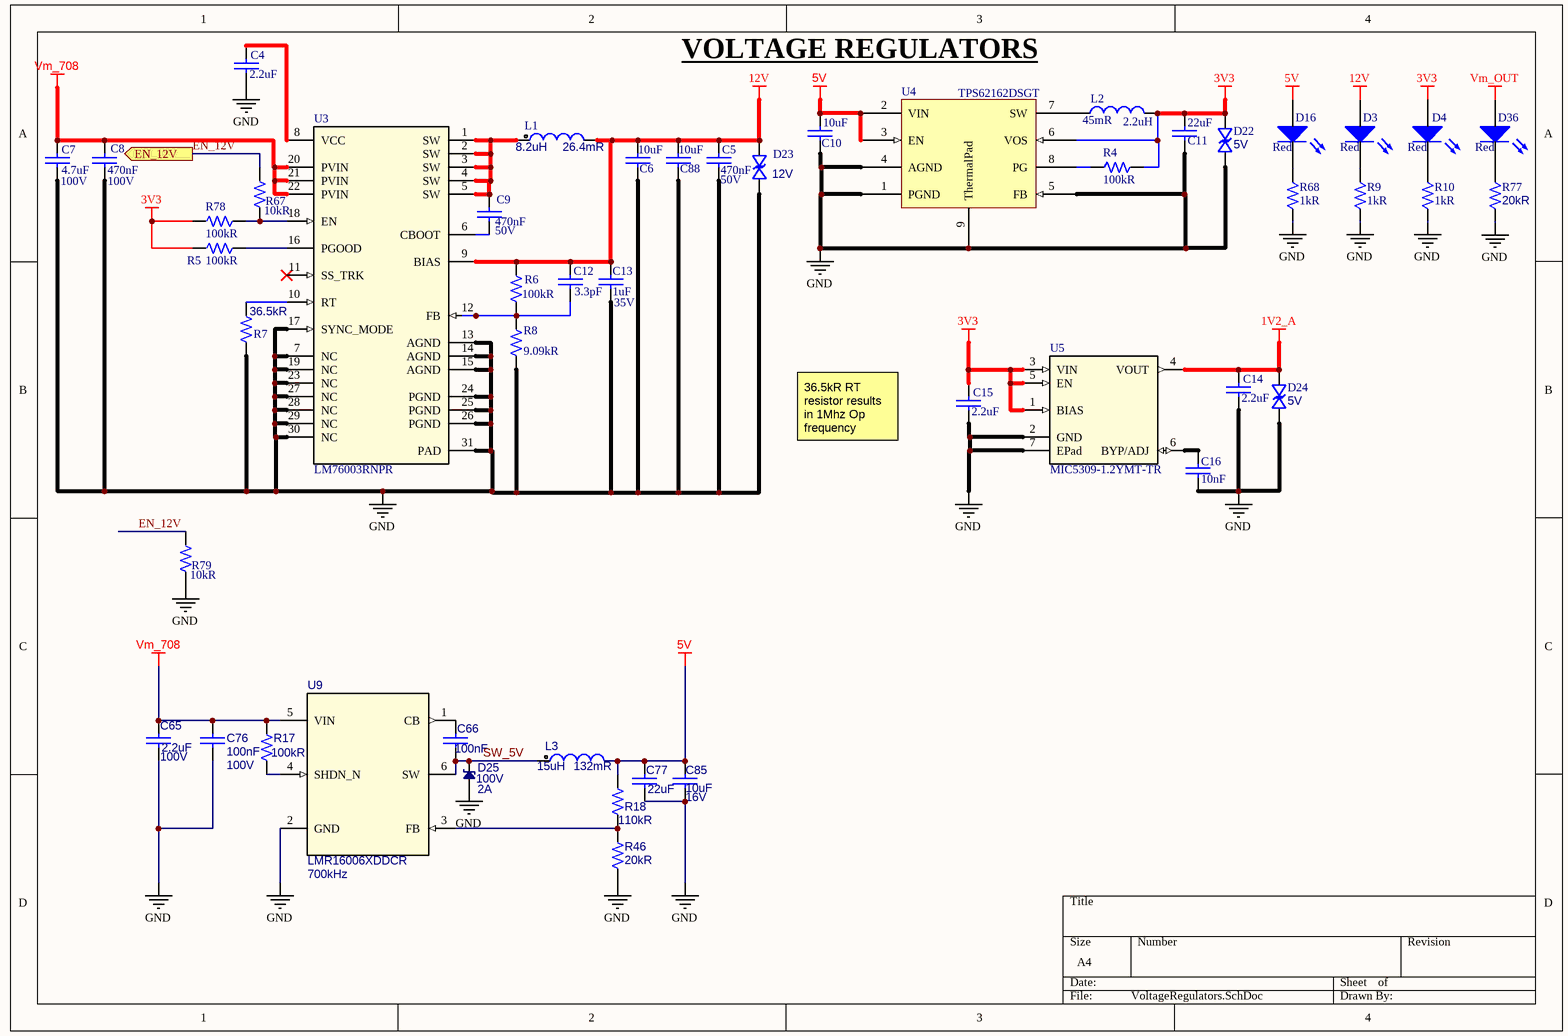
[diagram p6: VoltageRegulators.SchDoc]

### Parts
C4  Capacitance: 2.2uF  [CAP0402]  (hidden comment: Capacitor)
C5  Capacitance: 470nF  Voltage Rating: 50V  [CAP0603]  (hidden comment: Capacitor)
C6  value 10uF  [CAP0603]  (hidden comment: Capacitor)
C7  Capacitance: 4.7uF  Voltage Rating: 100V  [CAP1210]  (hidden comment: Capacitor)
C8  Capacitance: 470nF  Voltage Rating: 100V  [CAP0805]  (hidden comment: Capacitor)
C9  Capacitance: 470nF  Voltage Rating: 50V  [CAP0603]  (hidden comment: Capacitor)
C10  value 10uF  [CAP0603]  (hidden comment: Capacitor)
C11  value 22uF  [CAP0603]  (hidden comment: Capacitor)
C12  Capacitance: 3.3pF  [CAP0402]  (hidden comment: Capacitor)
C13  Voltage Rating: 35V  Capacitance: 1uF  [CAP0402]  (hidden comment: Capacitor)
C14  Capacitance: 2.2uF  [CAP0402]  (hidden comment: Capacitor)
C15  Capacitance: 2.2uF  [CAP0402]  (hidden comment: Capacitor)
C16  Capacitance: 10nF  [CAP0402]  (hidden comment: Capacitor)
C65  Capacitance: 2.2uF  Voltage Rating: 100V  [CAP1206]  (hidden comment: Capacitor)
C66  Capacitance: 100nF  [CAP0402]  (hidden comment: Capacitor)
C76  Capacitance: 100nF  Voltage Rating: 100V  [CAP0402]  (hidden comment: Capacitor)
C77  Capacitance: 22uF  [CAP0805]  (hidden comment: Capacitor)
C85  Capacitance: 10uF  Voltage Rating (DC): 16V  [CAP0603]  (hidden comment: Capacitor)
C88  value 10uF  [CAP0603]  (hidden comment: Capacitor)
D3  Colour: Red  [LED-0603-RED]  (hidden comment: LED)
D4  Colour: Red  [LED-0603-RED]  (hidden comment: LED)
D16  Colour: Red  [LED-0603-RED]  (hidden comment: LED)
D22  Reverse Standoff Voltage: 5V  [SLP1006P2T]  (hidden comment: TVS-Bidirectional)
D23  Working Voltage: 12V  [SLP1006P2T]  (hidden comment: TVS-Bidirectional)
D24  Reverse Standoff Voltage: 5V  [SLP1006P2T]  (hidden comment: TVS-Bidirectional)
D25  Max Reverse Voltage (DC): 100V  Average Rectified Current: 2A  [SOD-123F]  (hidden comment: Diode)
D36  Colour: Red  [LED-0603-RED]  (hidden comment: LED)
L1  Inductance: 8.2uH  DC Resistance (DCR): 26.4mR  [IND_ XAL6060-682MEB]  (hidden comment: Inductor)
L2  Inductance: 2.2uH  DC Resistance (DCR): 45mR  [IFSC-1515AH-ER2R2M01]  (hidden comment: Inductor)
L3  Inductance: 15uH  DC Resistance (DCR): 132mR  [IND_74404043---A]  (hidden comment: Inductor)
R4  Resistance: 100kR  [RES0402]  (hidden comment: Resistor)
R5  Resistance: 100kR  [RES0402]  (hidden comment: Resistor)
R6  Resistance: 100kR  [RES0402]  (hidden comment: Resistor)
R7  Resistance: 36.5kR  [RES0402]  (hidden comment: Resistor)
R8  Resistance: 9.09kR  [RES0402]  (hidden comment: Resistor)
R9  Resistance: 1kR  [RES0402]  (hidden comment: Resistor)
R10  Resistance: 1kR  [RES0402]  (hidden comment: Resistor)
R17  Resistance: 100kR  [RES0402]  (hidden comment: Resistor)
R18  Resistance: 110kR  [RES0402]  (hidden comment: Resistor)
R46  Resistance: 20kR  [RES0402]  (hidden comment: Resistor)
R67  Resistance: 10kR  [RES0402]  (hidden comment: Resistor)
R68  Resistance: 1kR  [RES0402]  (hidden comment: Resistor)
R77  Resistance: 20kR  [RES0603]  (hidden comment: Resistor)
R78  Resistance: 100kR  [RES0402]  (hidden comment: Resistor)
R79  Resistance: 10kR  [RES0402]  (hidden comment: Resistor)
U3  LM76003RNPR  [LM76003]
U4  Manufacturer Part Number 1: TPS62162DSGT  [TPS6216X]  (hidden comment: 3-17v Switching Reg)
U5  Manufacturer Part Number 1: MIC5309-1.2YMT-TR  [MIC5309]  (hidden comment: MIC5309-xx)
U9  Manufacturer Part Number 1: LMR16006XDDCR  Switching Frequency: 700kHz  [SOT23-6]  (hidden comment: IC REG BUCK ADJ 600MA TSOT23-6)

### Ports
EN_12V (out)

### Nets
1V2_A: C14.1 D24.1 U5.4(VOUT)
3V3: C11.1 C15.1 D4.2 D22.1 L2.2 R4.1 R5.2 R78.2 U4.6(VOS) U5.1(BIAS) U5.3(VIN) U5.5(EN)
5V: C10.1 C77.1 C85.1 D16.2 L3.2 R18.2 U4.2(VIN) U4.3(EN)
12V: C5.1 C6.1 C12.1 C13.2 C88.1 D3.2 D23.2 L1.2 R6.2 U3.9(BIAS)
GND: C4.2 C5.2 C6.2 C7.1 C8.2 C10.2 C11.2 C13.1 C14.2 C15.2 C16.2 C65.2 C76.2 C77.2 C85.2 C88.2 D22.2 D23.1 D24.2 D25.2 R7.1 R8.1 R9.1 R10.1 R46.1 R68.1 R77.1 R79.1 U3.7(NC) U3.13(AGND) U3.14(AGND) U3.15(AGND) U3.17(SYNC_MODE) U3.19(NC) U3.23(NC) U3.24(PGND) U3.25(PGND) U3.26(PGND) U3.27(NC) U3.28(NC) U3.29(NC) U3.30(NC) U3.31(PAD) U4.1(PGND) U4.4(AGND) U4.5(FB) U4.9(ThermalPad) U5.2(GND) U5.7(EPad) U9.2(GND)
Vm_708: C7.2 C8.1 C65.1 C76.1 R17.2 U3.20(PVIN) U3.21(PVIN) U3.22(PVIN) U9.5(VIN)
Vm_OUT: D36.2
EN_12V: R67.2 R79.2 ; port EN_12V
SW_5V: C66.2 D25.1 L3.1 U9.6(SW)
NetC4_1: C4.1 U3.8(VCC)
NetC9_1: C9.1 L1.1 U3.1(SW) U3.2(SW) U3.3(SW) U3.4(SW) U3.5(SW)
NetC9_2: C9.2 U3.6(CBOOT)
NetC12_2: C12.2 R6.1 R8.2 U3.12(FB)
NetC16_1: C16.1 U5.6(BYP/ADJ)
NetC66_1: C66.1 U9.1(CB)
NetD3_1: D3.1 R9.2
NetD4_1: D4.1 R10.2
NetD16_1: D16.1 R68.2
NetD36_1: D36.1 R77.2
NetL2_1: L2.1 U4.7(SW)
NetR4_2: R4.2 U4.8(PG)
NetR5_1: R5.1 U3.16(PGOOD)
NetR7_2: R7.2 U3.10(RT)
NetR17_1: R17.1 U9.4(SHDN_N)
NetR18_1: R18.1 R46.2 U9.3(FB)
NetR67_1: R67.1 R78.1 U3.18(EN)

Not connected (* = marked no-connect by the designer): U3 11(SS_TRK)*

### Notes on the sheet
- VOLTAGE REGULATORS
- 36.5kR RT resistor results in 1Mhz Op frequency